# EAGLE board Z573 Holder Mark1 (EAGLE 9.6.2)
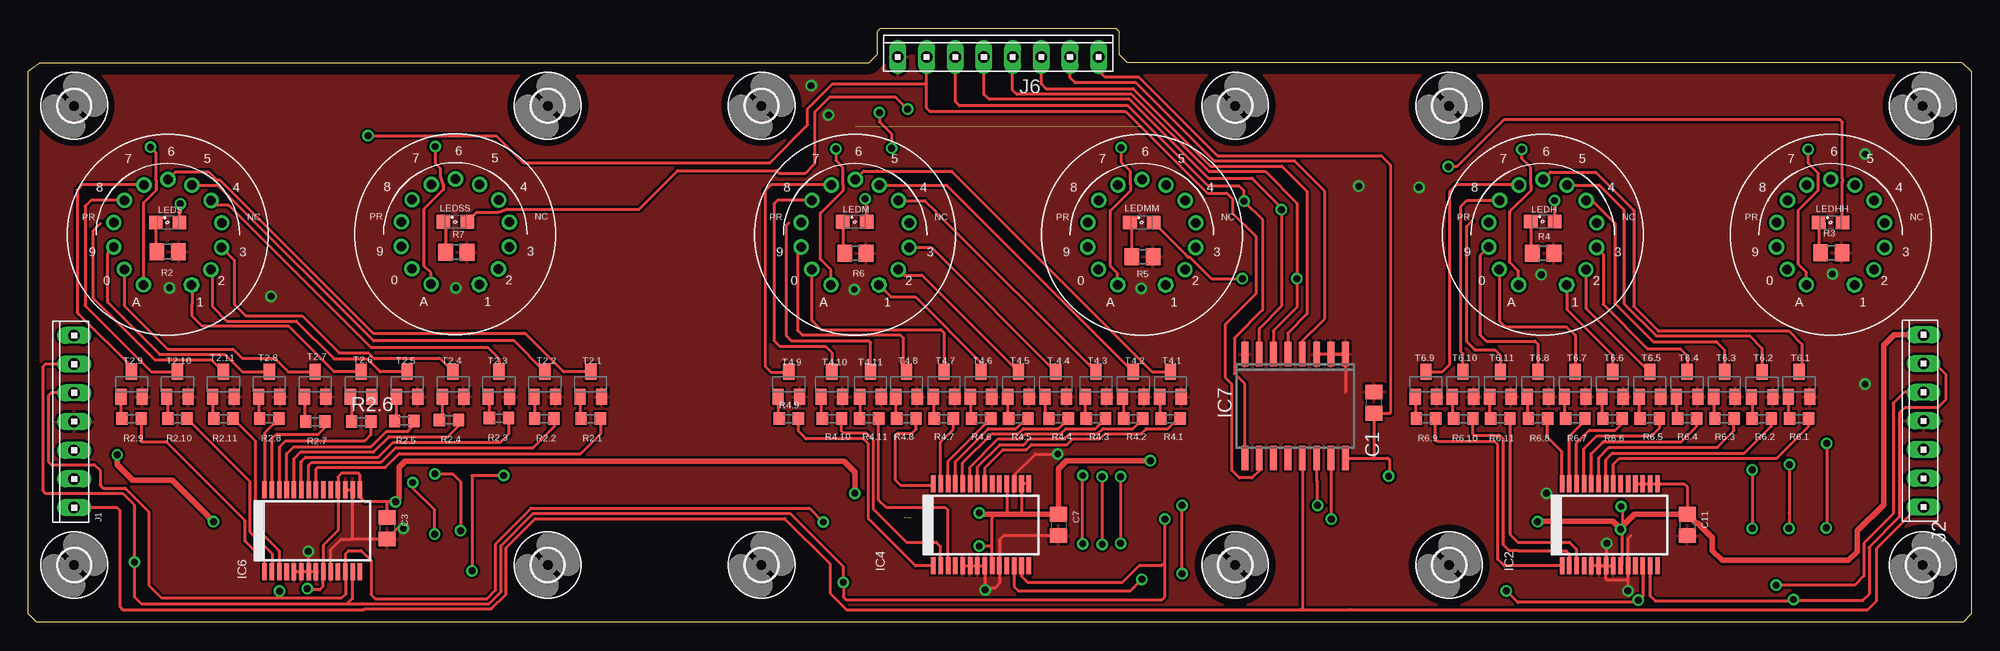
[diagram p3: board, top side]
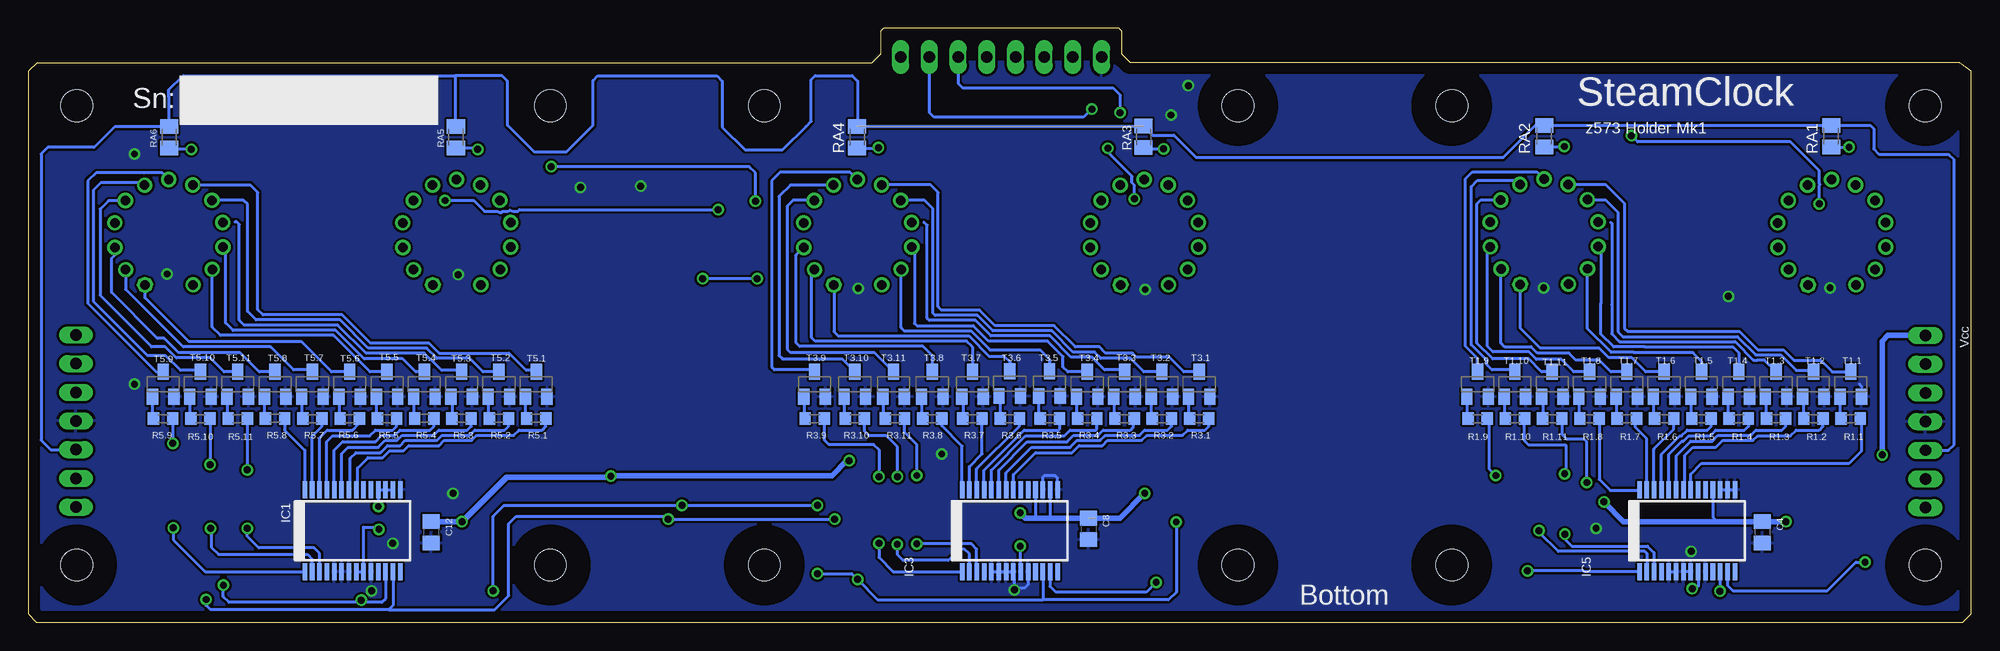
[diagram p4: board, bottom side, seen from below]

Size 171.96 x 52.58 mm. Coordinates in mm from the lower left corner, seen from the top.
Outline: 171.15,49.53 171.96,48.77 171.96,0.76 171.25,0 0.76,0 0,0.76 0,48.77 1.02,49.53 74.42,49.53 75.18,50.29 75.18,52.32 75.44,52.58 96.27,52.58 96.52,52.32 96.52,50.29 97.28,49.53 171.15,49.53
Copper layers (1*16): Top 0.035mm / dielectric 1.5mm / Bottom 0.035mm
Design rules "default": minimum track width 10mil, minimum drill 24mil, track to track 8mil, track to pad 8mil, pad to pad 8mil, via to via 8mil, smd to smd 8mil, copper to edge 40mil, drill to drill 8mil, minimum pad ring 10mil, minimum via ring 8mil, stop-mask expansion 4mil, vias tented up to drill 0mil, thermal gap 10mil

## Footprints (pad centres in the part's own frame; a part is rotated, then mirrored left to right if it is on the bottom)
C0805 = smd 1.3 x 1.5: 1 -0.95,0; 2 0.95,0
2,8 = hole 2.8: 0,0
SSOP28 = smd 0.4 x 1.5: 1 -4.225,-3.625; 2 -3.575,-3.625; 3 -2.925,-3.625; 4 -2.275,-3.625; 5 -1.625,-3.625; 6 -0.975,-3.625; 7 -0.325,-3.625; 8 0.325,-3.625; 9 0.975,-3.625; 10 1.625,-3.625; 11 2.275,-3.625; 12 2.925,-3.625; 13 3.575,-3.625; 14 4.225,-3.625; 15 4.225,3.625; 16 3.575,3.625; 17 2.925,3.625; 18 2.275,3.625; 19 1.625,3.625; 20 0.975,3.625; 21 0.325,3.625; 22 -0.325,3.625; 23 -0.975,3.625; 24 -1.625,3.625; 25 -2.275,3.625; 26 -2.925,3.625; 27 -3.575,3.625; 28 -4.225,3.625
SO16W = smd 0.6 x 2.2: 1 -4.445,-4.6; 2 -3.175,-4.6; 3 -1.905,-4.6; 4 -0.635,-4.6; 5 0.635,-4.6; 6 1.905,-4.6; 7 3.175,-4.6; 8 4.445,-4.6; 9 4.445,4.6; 10 3.175,4.6; 11 1.905,4.6; 12 0.635,4.6; 13 -0.635,4.6; 14 -1.905,4.6; 15 -3.175,4.6; 16 -4.445,4.6
10X07MTA = drill 1.016 long: 1 7.62,0; 2 5.08,0; 3 2.54,0; 4 0,0; 5 -2.54,0; 6 -5.08,0; 7 -7.62,0
10X08MTA = drill 1.016 long: 1 8.89,0; 2 6.35,0; 3 3.81,0; 4 1.27,0; 5 -1.27,0; 6 -3.81,0; 7 -6.35,0; 8 -8.89,0
SML0805 = smd 1.2 x 1.2: A 1.05,0; C -1.05,0
R0603 = smd 1 x 1.1: 1 -0.85,0; 2 0.85,0
R0805 = smd 1.3 x 1.5: 1 -0.95,0; 2 0.95,0
M0805 = smd 1.3 x 1.6: 1 -0.95,0; 2 0.95,0
SOT23 = smd 1 x 1.4: 1 -0.95,-1.1; 2 0.95,-1.1; 3 0,1.1
Z573M = drill 0.838 octagon: P$1 2.112,-4.422 | drill 0.838: P$2 3.821,-3.067; P$3 4.774,-1.106; P$4 4.781,1.075; P$5 3.841,3.043; P$6 2.14,4.408; P$7 0.016,4.9; P$8 -2.112,4.422; P$9 -3.821,3.067; P$10 -4.774,1.106; P$11 -4.781,-1.075; P$12 -3.841,-3.043; P$13 -2.14,-4.408

## Placement (x,y rotation side)
C1  0.1uF  [C0805]  119.08,19.46 90 top
C3  0.1uF  [C0805]  31.75,8.33 270 top
C4  0.1uF  [C0805]  18.49,7.98 270 bottom
C7  0.1uF  [C0805]  91.19,8.64 270 top
C8  0.1uF  [C0805]  78.13,8.28 270 bottom
C11  0.1uF  [C0805]  146.81,8.64 270 top
C12  0.1uF  [C0805]  136.3,7.98 270 bottom
H1  MOUNT-HOLE2.8  [2,8]  4.06,45.72 0 top
H6  MOUNT-HOLE2.8  [2,8]  45.97,45.72 0 top
H7  MOUNT-HOLE2.8  [2,8]  4.06,5.08 0 top
H8  MOUNT-HOLE2.8  [2,8]  45.97,5.08 0 top
H13  MOUNT-HOLE2.8  [2,8]  64.9,45.72 0 top
H14  MOUNT-HOLE2.8  [2,8]  106.81,45.72 0 top
H15  MOUNT-HOLE2.8  [2,8]  64.9,5.08 0 top
H16  MOUNT-HOLE2.8  [2,8]  106.81,5.08 0 top
H21  MOUNT-HOLE2.8  [2,8]  125.76,45.72 0 top
H22  MOUNT-HOLE2.8  [2,8]  167.67,45.72 0 top
H23  MOUNT-HOLE2.8  [2,8]  125.76,5.08 0 top
H24  MOUNT-HOLE2.8  [2,8]  167.67,5.08 0 top
IC1  MCP23017SS  [SSOP28]  143.26,8.13 0 bottom
IC2  MCP23017SS  [SSOP28]  139.95,8.64 0 top
IC3  MCP23017SS  [SSOP28]  85.09,8.13 0 bottom
IC4  MCP23017SS  [SSOP28]  84.33,8.64 0 top
IC5  MCP23017SS  [SSOP28]  25.15,8.13 0 bottom
IC6  MCP23017SS  [SSOP28]  25.15,8.13 0 top
IC7  PCF8574T  [SO16W]  112.12,19.15 180 top
J1  BUS  [10X07MTA]  4.06,17.78 90 top
J2  BUS  [10X07MTA]  167.74,17.83 90 top
J6  [10X08MTA]  85.85,50.04 0 top
LEDH  LS R976  [SML0805]  134.04,35.5 0 top
LEDHH  LS R976  [SML0805]  159.51,35.41 0.3 top
LEDM  LS R976  [SML0805]  73.15,35.46 0 top
LEDMM  LS R976  [SML0805]  98.55,35.41 0 top
LEDS  LS R976  [SML0805]  12.34,35.41 0 top
LEDSS  LS R976  [SML0805]  37.8,35.46 0 top
R1.1  10k  [R0603]  10.67,18.03 0 bottom
R1.2  10k  [R0603]  13.97,18.03 0 bottom
R1.3  10k  [R0603]  17.27,18.03 0 bottom
R1.4  10k  [R0603]  20.57,18.03 0 bottom
R1.5  10k  [R0603]  23.88,18.03 0 bottom
R1.6  10k  [R0603]  27.18,18.03 0 bottom
R1.7  10k  [R0603]  30.48,18.03 0 bottom
R1.8  10k  [R0603]  33.78,18.03 0 bottom
R1.9  10k  [R0603]  43.69,18.03 0 bottom
R1.10  10k  [R0603]  40.39,18.03 0 bottom
R1.11  10k  [R0603]  37.08,18.03 0 bottom
R2  1k  [R0805]  12.34,32.82 180 top
R2.1  10k  [R0603]  49.78,18.03 0 top
R2.2  10k  [R0603]  45.67,18.03 0 top
R2.3  10k  [R0603]  41.66,18.08 0 top
R2.4  10k  [R0603]  37.24,17.93 0 top
R2.5  10k  [R0603]  33.27,17.83 0 top
R2.6  10k  [R0603]  29.46,17.78 0 top
R2.7  10k  [R0603]  25.4,17.78 0 top
R2.8  10k  [R0603]  21.34,18.03 0 top
R2.9  10k  [R0603]  9.14,18.03 0 top
R2.10  10k  [R0603]  13.21,18.03 0 top
R2.11  10k  [R0603]  17.27,18.03 0 top
R3  1k  [R0805]  159.56,32.72 180 top
R3.1  10k  [R0603]  68.33,18.03 0 bottom
R3.2  10k  [R0603]  71.63,18.03 0 bottom
R3.3  10k  [R0603]  74.93,18.03 0 bottom
R3.4  10k  [R0603]  78.23,18.03 0 bottom
R3.5  10k  [R0603]  81.53,18.03 0 bottom
R3.6  10k  [R0603]  85.09,18.03 0 bottom
R3.7  10k  [R0603]  88.39,18.03 0 bottom
R3.8  10k  [R0603]  91.95,18.03 0 bottom
R3.9  10k  [R0603]  102.36,18.03 0 bottom
R3.10  10k  [R0603]  98.81,18.03 0 bottom
R3.11  10k  [R0603]  95.25,18.03 0 bottom
R4  1k  [R0805]  134.06,32.66 180 top
R4.1  10k  [R0603]  101.09,18.03 0 top
R4.2  10k  [R0603]  97.79,18.03 0 top
R4.3  10k  [R0603]  94.49,18.03 0 top
R4.4  10k  [R0603]  91.19,18.03 0 top
R4.5  10k  [R0603]  87.63,18.03 0 top
R4.6  10k  [R0603]  84.33,18.03 0 top
R4.7  10k  [R0603]  81.03,18.03 0 top
R4.8  10k  [R0603]  77.72,18.03 0 top
R4.9  10k  [R0603]  67.31,18.03 0 top
R4.10  10k  [R0603]  71.12,18.03 0 top
R4.11  10k  [R0603]  74.42,18.03 0 top
R5  1k  [R0805]  98.6,32.36 180 top
R5.1  10k  [R0603]  127,18.06 0 bottom
R5.2  10k  [R0603]  130.3,18.06 0 bottom
R5.3  10k  [R0603]  133.6,18.06 0 bottom
R5.4  10k  [R0603]  136.91,18.06 0 bottom
R5.5  10k  [R0603]  140.21,18.03 0 bottom
R5.6  10k  [R0603]  143.51,18.03 0 bottom
R5.7  10k  [R0603]  146.81,18.03 0 bottom
R5.8  10k  [R0603]  150.11,18.06 0 bottom
R5.9  10k  [R0603]  160.02,18.03 0 bottom
R5.10  10k  [R0603]  156.72,18.03 0 bottom
R5.11  10k  [R0603]  153.42,18.03 0 bottom
R6  1k  [R0805]  73.2,32.66 180 top
R6.1  10k  [R0603]  156.72,18.03 0 top
R6.2  10k  [R0603]  153.42,18.03 0 top
R6.3  10k  [R0603]  150.11,18.03 0 top
R6.4  10k  [R0603]  146.81,18.03 0 top
R6.5  10k  [R0603]  143.51,18.03 0 top
R6.6  10k  [R0603]  140.21,18.03 0 top
R6.7  10k  [R0603]  136.91,18.03 0 top
R6.8  10k  [R0603]  133.6,18.03 0 top
R6.9  10k  [R0603]  123.7,18.03 0 top
R6.10  10k  [R0603]  127,18.03 0 top
R6.11  10k  [R0603]  130.28,18.03 0 top
R7  1k  [R0805]  37.9,32.77 180 top
RA1  22k  [M0805]  12.4,43.03 270 bottom
RA2  22k  [M0805]  37.8,43.03 270 bottom
RA3  22k  [M0805]  73.25,42.98 270 bottom
RA4  22k  [M0805]  98.6,42.93 270 bottom
RA5  10k  [M0805]  134.11,42.93 270 bottom
RA6  10k  [M0805]  159.49,42.93 270 bottom
T1.1  MMBTA42  [SOT23]  10.67,21.08 0 bottom
T1.2  MMBTA42  [SOT23]  13.97,21.08 0 bottom
T1.3  MMBTA42  [SOT23]  17.27,21.08 0 bottom
T1.4  MMBTA42  [SOT23]  20.57,21.08 0 bottom
T1.5  MMBTA42  [SOT23]  23.88,21.08 0 bottom
T1.6  MMBTA42  [SOT23]  27.18,21.08 0 bottom
T1.7  MMBTA42  [SOT23]  30.48,21.08 0 bottom
T1.8  MMBTA42  [SOT23]  33.78,21.08 0 bottom
T1.9  MMBTA42  [SOT23]  43.69,21.08 0 bottom
T1.10  MMBTA42  [SOT23]  40.39,21.08 0 bottom
T1.11  MMBTA42  [SOT23]  37.08,21.08 0 bottom
T2.1  MMBTA42  [SOT23]  49.78,21.08 0 top
T2.2  MMBTA42  [SOT23]  45.72,21.08 0 top
T2.3  MMBTA42  [SOT23]  41.66,21.08 0 top
T2.4  MMBTA42  [SOT23]  37.59,21.08 0 top
T2.5  MMBTA42  [SOT23]  33.53,21.08 0 top
T2.6  MMBTA42  [SOT23]  29.46,21.08 0 top
T2.7  MMBTA42  [SOT23]  25.4,21.08 0 top
T2.8  MMBTA42  [SOT23]  21.34,21.08 0 top
T2.9  MMBTA42  [SOT23]  9.14,21.08 0 top
T2.10  MMBTA42  [SOT23]  13.21,21.08 0 top
T2.11  MMBTA42  [SOT23]  17.27,21.08 0 top
T3.1  MMBTA42  [SOT23]  68.33,21.08 0 bottom
T3.2  MMBTA42  [SOT23]  71.63,21.08 0 bottom
T3.3  MMBTA42  [SOT23]  74.93,21.08 0 bottom
T3.4  MMBTA42  [SOT23]  78.23,21.08 0 bottom
T3.5  MMBTA42  [SOT23]  81.58,21.13 0 bottom
T3.6  MMBTA42  [SOT23]  85.09,21.13 0 bottom
T3.7  MMBTA42  [SOT23]  88.39,21.08 0 bottom
T3.8  MMBTA42  [SOT23]  91.95,21.08 0 bottom
T3.9  MMBTA42  [SOT23]  102.36,21.08 0 bottom
T3.10  MMBTA42  [SOT23]  98.81,21.08 0 bottom
T3.11  MMBTA42  [SOT23]  95.38,21.08 0 bottom
T4.1  MMBTA42  [SOT23]  101.09,21.08 0 top
T4.2  MMBTA42  [SOT23]  97.79,21.08 0 top
T4.3  MMBTA42  [SOT23]  94.49,21.08 0 top
T4.5  MMBTA42  [SOT23]  87.63,21.08 0 top
T4.6  MMBTA42  [SOT23]  84.33,21.08 0 top
T4.7  MMBTA42  [SOT23]  81.05,21.08 0 top
T4.8  MMBTA42  [SOT23]  77.72,21.08 0 top
T4.9  MMBTA42  [SOT23]  67.31,21.08 0 top
T4.10  MMBTA42  [SOT23]  71.12,21.08 0 top
T4.11  MMBTA42  [SOT23]  74.55,21.08 0 top
T5.1  MMBTA42  [SOT23]  127,21.08 0 bottom
T5.2  MMBTA42  [SOT23]  130.3,21.08 0 bottom
T5.3  MMBTA42  [SOT23]  133.6,21.08 0 bottom
T5.4  MMBTA42  [SOT23]  136.91,21.08 0 bottom
T5.5  MMBTA42  [SOT23]  140.21,21.08 0 bottom
T5.6  MMBTA42  [SOT23]  143.51,21.08 0 bottom
T5.7  MMBTA42  [SOT23]  146.81,21.08 0 bottom
T5.8  MMBTA42  [SOT23]  150.11,21.08 0 bottom
T5.9  MMBTA42  [SOT23]  160.02,21.08 0 bottom
T5.10  MMBTA42  [SOT23]  156.72,21.08 0 bottom
T5.11  MMBTA42  [SOT23]  153.42,21.08 0 bottom
T6.1  MMBTA42  [SOT23]  156.72,21.08 0 top
T6.2  MMBTA42  [SOT23]  153.44,21.06 0 top
T6.3  MMBTA42  [SOT23]  150.11,21.08 0 top
T6.4  MMBTA42  [SOT23]  146.81,21.08 0 top
T6.5  MMBTA42  [SOT23]  143.51,21.08 0 top
T6.6  MMBTA42  [SOT23]  140.21,21.08 0 top
T6.7  MMBTA42  [SOT23]  136.91,21.08 0 top
T6.8  MMBTA42  [SOT23]  133.6,21.08 0 top
T6.9  MMBTA42  [SOT23]  123.7,21.08 0 top
T6.10  MMBTA42  [SOT23]  126.97,21.08 0 top
T6.11  MMBTA42  [SOT23]  130.28,21.08 0 top
T.4.4  MMBTA42  [SOT23]  90.93,21.08 0 top
U$1  Z573  [Z573M]  12.34,34.29 0 top
U$2  Z573  [Z573M]  37.8,34.34 0 top
U$3  Z573  [Z573M]  98.55,34.29 0 top
U$4  Z573  [Z573M]  73.18,34.29 0 top
U$5  Z573  [Z573M]  159.51,34.29 0 top
U$6  Z573  [Z573M]  134.04,34.29 0 top

## Tracks (layer width: path | path; a pad name or v marks a point on that pad's centre or on a via)
2-E10
  Top 0.254: T2.2.1 44.82,19.93 R2.2.1
2-E11
  Top 0.254: T2.3.1 40.81,19.88 R2.3.1
2-E12
  Top 0.254: T2.4.1 36.64,18.19 R2.4.1
2-E13
  Top 0.254: T2.5.1 32.58,17.98 R2.5.1
2-E15
  Top 0.254: R2.7.1 24.45,17.88 T2.7.1
2-E16
  Top 0.254: T2.8.1 20.39,18.13 R2.8.1
2-E17
  Top 0.254: T2.9.1 8.19,18.13 R2.9.1
2-E18
  Top 0.254: T2.10.1 12.36,19.88 R2.10.1
2-E19
  Top 0.254: R2.1.1 48.83,18.13 T2.1.1
2-E30
  Top 0.254: T4.2.1 96.94,19.88 R4.2.1
2-E31
  Top 0.254: T4.3.1 93.54,18.13 R4.3.1
2-E32
  Top 0.254: T.4.4.1 89.98,18.39 R4.4.1
2-E33
  Top 0.254: T4.5.1 86.68,18.13 R4.5.1
2-E34
  Top 0.254: R4.6.1 83.39,18.12 83.38,18.13 T4.6.1
2-E35
  Top 0.254: T4.7.1 80.1,18.11 R4.7.1
2-E36
  Top 0.254: T4.8.1 76.77,18.13 R4.8.1
2-E37
  Top 0.254: R4.9.1 66.36,18.13 T4.9.1
2-E38
  Top 0.254: T4.10.1 70.17,18.13 R4.10.1
2-E39
  Top 0.254: R4.1.1 100.14,18.13 T4.1.1
2-E50
  Top 0.254: T6.2.1 152.57,19.88 R6.2.1
2-E51
  Top 0.254: T6.3.1 149.16,18.13 R6.3.1
2-E52
  Top 0.254: T6.4.1 145.86,18.13 R6.4.1
2-E53
  Top 0.254: T6.5.1 142.56,18.13 R6.5.1
2-E54
  Top 0.254: T6.6.1 139.26,18.13 R6.6.1
2-E55
  Top 0.254: T6.7.1 135.96,18.13 R6.7.1
2-E56
  Top 0.254: T6.8.1 132.65,18.13 R6.8.1
2-E57
  Top 0.254: T6.9.1 122.75,18.13 R6.9.1
2-E58
  Top 0.254: T6.10.1 126.03,18.16 R6.10.1
2-E59
  Top 0.254: T6.1.1 155.77,18.13 R6.1.1
2-R12
  Top 0.254: IC6.23 24.17,14.2 24.16,14.26 24.54,14.63 30.97,14.63 32.28,15.94 41.79,15.94 42.51,16.65 R2.3.2
2-R16
  Top 0.254: R2.7.2 26.25,17.25 25.65,16.65 21.94,16.65 21.57,16.28 IC6.27
2-R17
  Top 0.254: R2.8.2 20.92,16.77 IC6.28
2-R18
  Top 0.254: R2.9.2 9.99,16 12.19,16 19.15,9.04 19.15,7.21 20.92,5.44 IC6.1
2-R19
  Top 0.254: IC6.2 21.57,6.08 19.61,8.04 19.61,12.48 R2.10.2
2-R30
  Top 0.254: R4.1.2 101.76,18.03 100.88,17.15 98.94,17.15 98.48,16.7 95.29,16.7 94.84,16.24 92.44,16.24 91.95,15.75 88.78,15.75 88.33,15.29 86.26,15.29 84.65,13.69 IC4.21
2-R31
  Top 0.254: R4.2.2 97.76,17.15 95.1,17.15 94.65,16.7 92.14,16.7 91.68,16.24 88.63,16.24 88.14,15.75 85.99,15.75 84,13.76 IC4.22
2-R32
  Top 0.254: R4.3.2 94.46,17.15 91.83,17.15 91.37,16.7 88.25,16.7 87.8,16.24 85.83,16.24 83.35,13.76 IC4.23
2-R33
  Top 0.254: R4.4.2 91.16,17.15 88.06,17.15 87.61,16.7 85.28,16.7 82.7,14.12 IC4.24
2-R34
  Top 0.254: R4.5.2 88.3,18.03 87.42,17.15 84.97,17.15 82.05,14.24 IC4.25
2-R35
  Top 0.254: IC4.26 81.4,14.26 R4.6.2
2-R36
  Top 0.254: R4.7.2 81.88,17.11 80.75,15.98 IC4.27
2-R37
  Top 0.254: R4.8.2 78.57,17.11 78.23,16.76 76.96,16.76 76.71,16.51 76.71,12.65 77.22,12.14 79.98,12.14 IC4.28
2-R38
  Top 0.254: R4.9.2 68.16,16.93 68.83,16.26 73.91,16.26 74.36,15.81 74.36,9.16 78.5,5.01 IC4.1
2-R39
  Top 0.254: R4.10.2 71.97,16.93 72.14,16.76 74.17,16.76 74.81,16.12 74.81,10.01 75.37,9.45 77.71,7.11 80.35,7.11 80.75,6.71 IC4.2
2-R50
  Top 0.254: R6.1.2 157.57,17.36 156.72,16.51 154.74,14.53 142.18,14.53 140.82,14.53 140.28,13.99 IC2.21
2-R51
  Top 0.254: R6.2.2 154.27,17.36 151.89,14.99 140.21,14.99 139.63,14.41 IC2.22
2-R52
  Top 0.254: R6.3.2 150.96,16.97 149.49,15.49 139.9,15.49 138.98,14.57 IC2.23
2-R53
  Top 0.254: R6.4.2 147.66,17.36 146.3,16 139.4,16 138.33,14.94 IC2.24
2-R54
  Top 0.254: R6.5.2 144.36,17.2 143.67,16.51 138.84,16.51 137.68,15.35 IC2.25
2-R55
  Top 0.254: R6.6.2 141.06,17.61 140.46,17.02 138.18,17.02 137.03,15.87 IC2.26
2-R56
  Top 0.254: R6.7.2 137.76,17.87 136.38,16.49 IC2.27
2-R57
  Top 0.254: IC2.28 135.73,15.1 134.45,16.37 R6.8.2
2-R58
  Top 0.254: R6.9.2 124.55,16.17 124.71,16 129.79,16 130.05,15.75 130.05,5.59 130.62,5.01 IC2.1
2-R59
  Top 0.254: R6.10.2 127.85,16.68 128.02,16.51 130.3,16.51 130.56,16.26 130.56,7.93 130.56,7.62 130.56,6.86 131.06,6.35 131.83,6.35 136.09,6.35 136.4,6.04 136.4,5.03 IC2.2
GND  (via drill 0.61)
  Top 0.254: T2.9.2 10.16,20.05 | T2.5.2 34.54,20.05 | 22.35,20.05 T2.8.2 22.1,20.17 | T6.8.2 134.62,20.05 | T6.7.2 137.92,20.05 | T6.6.2 141.22,20.05 | T6.5.2 144.53,20.05 | T6.1.2 157.73,20.05 | T6.2.2 154.43,20 | T6.3.2 151.13,20.05 | T6.4.2 147.83,20.05 | T4.1.2 102.11,20.05 | T4.11.2 75.69,20.18 | T4.8.2 78.74,20.05 | T4.7.2 82.3,20.28 | T4.6.2 85.6,20.3 | T4.5.2 88.65,20.05 | T.4.4.2 92.2,20.3 | T4.3.2 95.5,20.05 | T4.2.2 99.06,20.3 | IC7.1 IC7.3 | IC7.2 IC7.1 | IC6.17 IC6.16 28.72,7.38 | IC4.5 IC4.6 IC4.7 IC4.8 84.65,2.93 v84.68,2.9 84.84,3.05 85.55,3.05 85.95,3.45 IC4.10 85.95,7.31 86.32,7.69 C7.2 | IC2.7 IC2.5 | IC2.6 IC2.7 | IC7.1 116.56,20.41 | IC2.10 141.58,7.42 141.85,7.69 | IC6.7 24.82,6.27 v24.79,6.3 | IC2.7 139.7,5.08 v139.7,7.01 | IC2.10 141.58,3.86 141.48,3.76 139.75,3.76 139.63,3.88 IC2.7 | 28.72,7.38 C3.2 32.8,8.43 33.12,8.43 33.2,8.36 v33.2,8.32 | IC5.5 26.77,6.45 27.7,7.38 28.72,7.38 | IC2.10 v141.58,2.79 | IC6.8 IC6.7 | IC6.7 IC6.6 IC6.5 | IC4.17 87.37,12.38 87.37,13.15 89.13,14.91 v91.11,14.91 | IC2.7 IC2.8
  Bottom 0.254: 9.91,21.08 9.65,20.83 | 134.48,11.44 v134.37,11.43 | IC6.7 IC6.8 | IC3.17 82.16,12.88 82.04,13.01 81.08,13.01 80.86,12.79 IC3.15 | IC5.17 IC5.16 IC5.15 | IC5.5 IC5.6 | IC3.5 IC3.6 IC3.7 IC3.8 84.68,4.42 v84.68,2.9 84.53,3.05 83.77,3.05 83.47,3.35 IC3.10
  other vias: 162.56,21.08 21.49,28.85 70.82,44.91 69.29,47.5 159.66,30.84 133.91,30.78 98.5,29.57 73.1,29.46 37.85,29.62 12.5,29.62 123.09,38.51 117.75,38.61 162.56,41.45
  pour Bottom: -0.01,49.58 171.81,49.58 171.81,0 -0.01,0
  pour Top: -0.61,50.09 -0.61,-0.66 172.42,-0.66 172.42,50.09
H  (via drill 0.61)
  Top 0.254: J6.5 84.58,46.74 85.04,46.28 97.46,46.28 104.43,39.31 108.31,39.31 110.9,36.72 v110.9,36.52 110.9,27.96 108.94,26.01 IC7.7 | LEDH.A 135.09,37.33 v135.08,37.34
  Bottom 0.254: v135.08,37.34 132.54,37.34 131.57,36.37 130.44,36.37 130.15,36.27 129.95,36.37 129.55,36.37 129.33,36.48 129.02,36.37 128.63,36.37 128.47,36.52 v110.9,36.52
HH  (via drill 0.61)
  Top 0.254: IC7.9 107.67,21.11 106.73,22.05 106.73,25.15 109.25,27.66 109.25,32.89 109.22,32.92 109.22,35.66 v107.59,37.29 107.59,38.2 107.16,38.63 104.42,38.63 97.33,45.72 82.4,45.72 82.04,46.08 J6.6 | LEDHH.A 160.56,39.02 160.61,39.13 160.56,39.27 160.56,44.26 160.32,44.5 130.61,44.5 126.44,40.34 v125.68,40.34
  Bottom 0.254: v107.59,37.29 107.59,39.78 108.15,40.34 v125.68,40.34
HT  (1 unrouted)
  Bottom 0.254: J1.5 2.03,15.24 1.52,15.75 1.52,40.95 1.98,41.4 8.13,41.4 8.64,41.91 8.64,43.69 8.93,43.98 RA1.1 RA2.1 38.6,43.98 41.45,41.12 68.56,41.12 70.56,43.13 72.46,43.13 RA3.1 98.55,43.93 98.55,47.9 99.03,48.39 102.31,48.39 102.67,48.03 102.67,44.33 103.12,43.88 103.14,43.88 105.21,41.81 108.51,41.81 110.54,43.84 110.54,47.9 111,48.36 121.56,48.36 121.97,47.95 121.97,43.99 124.31,41.66 127.2,41.66 129.54,43.99 129.54,47.9 130.02,48.39 134.16,48.39 | J2.5 169.98,15.29 170.81,16.13 170.81,41.45 170.23,42.04 166.14,42.04 164.3,43.88 RA6.1 159.49,46.46 159.51,46.48 159.51,47.12 158.24,48.39 134.16,48.39 | RA5.1 134.11,48.34 134.16,48.39
INT
  Top 0.254: IC7.13 112.75,1.14 | J1.7 7.87,10.16 8.13,9.91 8.13,1.4 8.38,1.14 29.72,1.14 29.78,1.21 40.98,1.21 42.29,2.51 42.29,6.61 44.88,9.2 66.95,9.2 70.97,5.18 70.97,2.59 72.41,1.14 112.62,1.14 112.75,1.14 | J2.7 167.23,10.21 163.58,6.55 163.58,1.91 162.81,1.14 117.14,1.14 116.97,1.14 112.75,1.14
M  (via drill 0.61)
  Top 0.254: J6.3 89.66,47.65 90.07,47.24 97.79,47.24 104.65,40.39 110.95,40.39 113.18,38.15 113.18,27.3 111.48,25.6 IC7.5 | LEDM.A 74.2,37.36 v74.07,37.49 | v75.34,45.11 75.34,44.3 76.4,43.23 v76.4,41.96
  Bottom 0.254: v74.07,37.49 74.07,38.69 74.28,38.9 74.28,39.48 76.4,41.61 v76.4,41.96 | J6.3 89.66,47.7 89.26,47.3 75.95,47.3 75.34,46.69 v75.34,45.11
MM  (via drill 0.61)
  Top 0.254: J6.4 87.12,47.09 87.48,46.74 97.65,46.74 104.48,39.91 109.47,39.91 112.27,37.12 v112.27,30.43 112.27,27.89 110.19,25.81 110.19,23.78 IC7.6 | LEDMM.A 102.5,32.51 102.5,32.48 102.66,32.32 102.81,32.32 104.7,30.43 v107.44,30.43
  Bottom 0.254: v107.44,30.43 v112.27,30.43
N1-DOT  (via drill 0.61)
  Top 0.254: v35.97,7.82 35.97,9.96 34.04,11.89 v34.04,12.37 v34.02,12.38
  Bottom 0.254: R1.11.2 36.23,16.68 35.81,16.26 34.29,16.26 34.04,16 34.04,12.45 34.02,12.44 v34.02,12.38 | v35.97,7.82 35.97,7.37 35.36,6.76 28.65,6.76 28.07,6.18 IC5.3
N4-DOT
  Top 0.254: IC4.3 81.4,9.94 81.18,10.16 75.95,10.16 75.27,10.83 R4.11.2
N$2
  Top 0.254: R2.4.2 38.09,17.4 37.12,16.44 31.94,16.44 30.58,15.09 24.12,15.09 23.52,14.49 IC6.24
N$3
  Top 0.254: R2.1.2 50.63,16.69 48.88,14.94 32.83,14.94 31.61,13.72 25.6,13.72 25.47,13.58 IC6.21
N$4
  Bottom 0.254: R1.4.2 19.72,17.36 20.07,17.02 22.61,17.02 23.11,16.51 25.01,16.51 25.46,16.05 25.6,16.05 26.77,14.88 IC5.24
N$5
  Top 0.254: IC6.22 24.82,13.9 25.09,14.17 31.21,14.17 32.52,15.48 44.69,15.48 46.52,17.3 R2.2.2
N$6
  Bottom 0.254: R1.6.2 26.33,17.11 28.07,15.36 IC5.26
N$7
  Bottom 0.254: R1.7.2 29.72,18.03 29.72,17.27 28.72,16.27 IC5.27
N$8
  Bottom 0.254: R1.8.2 32.93,12.66 31.95,11.68 29.44,11.68 IC5.28
N$9  (via drill 0.61)
  Top 0.254: v42.09,13.01 39.27,13.01 v39.27,4.57
  Bottom 0.254: R1.9.2 42.67,17.87 42.67,13.59 v42.09,13.01 | IC5.1 34.22,4.5 34.29,4.57 v39.27,4.57
N$10  (via drill 0.61)
  Top 0.254: v35.99,13.16 37.57,13.16 38.25,12.47 v38.25,8.13
  Bottom 0.254: R1.10.2 39.54,16.09 39.55,16.08 39.17,15.7 35.89,15.7 35.89,13.26 v35.99,13.16 | v38.25,8.13 38.25,7.99 36.56,6.3 28.9,6.3 28.72,6.12 IC5.2
N$12
  Top 0.254: IC6.3 22.22,6.33 20.07,8.48 20.07,16.09 R2.11.2
N$13
  Top 0.254: T2.11.1 16.32,18.13 R2.11.1
N$14  (via drill 0.61)
  Top 0.254: U$2.P$13 35.66,30.94 35.05,31.54 35.05,36.6 36.77,38.31 36.77,38.7 36.5,39.48 36.5,40.15 36.02,40.63 v36.02,42.11
  Bottom 0.254: RA2.2 36.05,42.08 v36.02,42.11
N$15
  Bottom 0.254: R1.1.2 9.82,17.83 9.7,17.72 9.7,15.19 10.81,14.08 23.88,14.08 24.82,13.13 IC5.21
N$16
  Top 0.254: R2.5.2 34.12,17.46 33.58,16.92 31.7,16.92 30.33,15.54 23.47,15.54 22.87,14.95 IC6.25
N$17  (via drill 0.61)
  Top 0.254: U$3.P$13 96.41,30.89 95.76,31.54 95.76,36.45 97.58,38.26 97.58,38.72 97.53,38.76 97.53,39.93 96.72,40.74 v96.72,42.01
  Bottom 0.254: v96.72,42.01 96.76,41.98 RA4.2
N$18
  Top 0.254: R2.6.2 30.31,16.6 29.77,16.05 22.76,16.05 22.22,15.52 IC6.26
N$19
  Top 0.254: T2.6.1 28.61,19.88 R2.6.1
N$27
  Bottom 0.254: T1.2.1 14.82,19.88 R1.2.1
N$31
  Top 0.254: LEDS.C 11.29,32.92 R2.2
N$32
  Top 0.254: LEDHH.C 158.46,32.87 R3.2
N$33
  Top 0.254: LEDH.C 132.99,32.79 R4.2
N$34
  Top 0.254: LEDMM.C 97.65,35.26 R5.2
N$36
  Top 0.254: LEDM.C 72.1,32.81 R6.2
N$38
  Top 0.254: LEDSS.C 36.95,35.26 R7.2
N$51
  Bottom 0.254: T1.3.1 18.12,19.88 R1.3.1
N$52
  Bottom 0.254: T1.4.1 21.52,18.13 R1.4.1
N$53
  Bottom 0.254: T1.5.1 24.83,18.13 R1.5.1
N$54
  Bottom 0.254: T1.6.1 28.13,18.13 R1.6.1
N$55
  Bottom 0.254: R1.7.1 31.43,18.13 T1.7.1
N$56
  Bottom 0.254: T1.8.1 34.73,18.13 R1.8.1
N$57
  Bottom 0.254: T1.9.1 44.64,18.13 R1.9.1
N$58
  Bottom 0.254: T1.10.1 41.34,18.13 R1.10.1
N$59
  Bottom 0.254: T1.1.1 11.62,18.13 R1.1.1
N$61
  Bottom 0.254: R1.2.2 13.12,17.36 13.46,17.02 15.49,17.02 16,16.51 18.91,16.51 19.32,16.1 22,16.1 22.61,15.49 24.64,15.49 25.35,14.78 25.35,11.87 IC5.22
N$62
  Bottom 0.254: R1.3.2 16.42,17.36 16.76,17.02 19.05,17.02 19.51,16.56 22.42,16.56 22.93,16.05 24.82,16.05 26.12,14.75 IC5.23
N$64
  Bottom 0.254: R1.5.2 23.03,17.36 23.37,17.02 25.15,17.02 25.65,16.51 25.81,16.51 27.42,14.89 IC5.25
N$72  (via drill 0.61)
  Top 0.254: U$1.P$13 10.2,37.15 11.32,38.26 11.32,38.46 11.32,38.72 11.32,39.14 11.28,39.18 11.28,41.61 v10.82,42.06
  Bottom 0.254: RA1.2 12.38,42.06 v10.82,42.06
N$76
  Bottom 0.254: T1.11.1 37.93,19.88 R1.11.1
N$121
  Bottom 0.254: T3.2.1 72.58,18.13 R3.2.1
N$132
  Bottom 0.254: T3.3.1 75.88,18.13 R3.3.1
N$133
  Bottom 0.254: T3.4.1 79.18,18.13 R3.4.1
N$134
  Bottom 0.254: T3.5.1 82.53,18.18 R3.5.1
N$135
  Bottom 0.254: T3.6.1 85.94,19.93 R3.6.1
N$136
  Bottom 0.254: T3.7.1 89.24,19.88 R3.7.1
N$137
  Bottom 0.254: T3.8.1 92.9,18.13 R3.8.1
N$138
  Bottom 0.254: T3.9.1 103.31,18.13 R3.9.1
N$139
  Bottom 0.254: T3.10.1 99.76,18.13 R3.10.1
N$140
  Bottom 0.254: T3.1.1 69.28,18.13 R3.1.1
N$141
  Bottom 0.254: R3.1.2 67.48,17.36 67.82,17.02 69.34,17.02 69.8,16.56 72.96,16.56 73.42,16.1 76.44,16.1 76.9,15.65 78.96,15.65 79.57,15.04 82.8,15.04 84.77,13.08 IC3.21
N$142
  Bottom 0.254: R3.2.2 70.78,17.36 71.12,17.02 73.15,17.02 73.61,16.56 76.63,16.56 77.09,16.1 79.15,16.1 79.76,15.49 83.16,15.49 85.41,13.24 IC3.22
N$143
  Bottom 0.254: R3.3.2 74.17,17.95 74.17,17.27 74.42,17.02 76.82,17.02 77.28,16.56 79.45,16.56 80.02,15.99 83.55,15.99 86.06,13.48 IC3.23
N$144
  Bottom 0.254: R3.4.2 77.38,17.11 77.47,17.02 79.76,17.02 80.26,16.51 83.68,16.51 86.72,13.48 IC3.24
N$145
  Bottom 0.254: R3.5.2 80.68,17.11 80.77,17.02 83.82,17.02 87.36,13.47 IC3.25
N$146
  Bottom 0.254: R3.6.2 84.24,17.36 88.02,13.59 IC3.26
N$147
  Bottom 0.254: IC3.27 88.66,13.8 87.54,14.92 R3.7.2
N$148
  Bottom 0.254: IC3.28 89.31,15.6 91.1,17.39 R3.8.2
N$149  (via drill 0.61)
  Top 0.254: v96.67,12.9 v96.67,7.01
  Bottom 0.254: R3.9.2 101.51,16.17 101.09,15.75 97.13,15.75 96.67,15.29 v96.67,12.9 | IC3.1 95.4,4.5 96.67,5.77 v96.67,7.01
N$150  (via drill 0.61)
  Top 0.254: v95.03,12.9 95.05,12.89 v95.05,6.91
  Bottom 0.254: R3.10.2 97.96,16.93 97.54,16.51 96.01,16.51 95.03,15.53 v95.03,12.9 | IC3.2 88.66,6.06 89.1,6.5 89.51,6.5 90.53,5.49 94.54,5.49 95.05,5.99 v95.05,6.91
N$153  (via drill 0.61)
  Top 0.254: v71.48,41.91 71.48,40.89 72.11,40.26 72.11,38.76 72.15,38.72 72.15,38.26 70.1,36.22 70.1,32.12 71.04,31.19 U$4.P$13
  Bottom 0.254: v71.48,41.91 73.14,41.91 RA3.2
N$157
  Bottom 0.254: T3.11.1 96.33,18.26 R3.11.1
N$158
  Top 0.254: T4.11.1 73.6,18.06 R4.11.1
N$201
  Bottom 0.254: T5.2.1 131.25,18.16 R5.2.1
N$212
  Bottom 0.254: T5.3.1 134.45,19.88 R5.3.1
N$213
  Bottom 0.254: T5.4.1 137.86,18.16 R5.4.1
N$214
  Bottom 0.254: T5.5.1 141.16,18.13 R5.5.1
N$215
  Bottom 0.254: T5.6.1 144.46,18.13 R5.6.1
N$216
  Bottom 0.254: T5.7.1 147.76,18.13 R5.7.1
N$217
  Bottom 0.254: R5.8.1 151.06,18.16 T5.8.1
N$218
  Bottom 0.254: T5.9.1 160.97,18.13 R5.9.1
N$219
  Bottom 0.254: T5.10.1 157.67,18.13 R5.10.1
N$220
  Bottom 0.254: R5.1.1 127.95,18.16 T5.1.1
N$221
  Bottom 0.254: R5.1.2 126.15,17.36 126.49,17.02 128.52,17.02 128.98,16.56 132.26,16.56 132.72,16.1 135.14,16.1 135.6,15.65 138.28,15.65 138.73,15.19 139.98,15.19 140.59,14.58 141.88,14.58 142.81,13.65 142.81,11.87 IC1.21
N$222
  Bottom 0.254: R5.2.2 129.45,17.36 129.79,17.02 132.45,17.02 132.91,16.56 135.33,16.56 135.79,16.1 138.58,16.1 139.04,15.65 140.17,15.65 140.78,15.04 142.95,15.04 143.46,14.53 143.46,11.87 IC1.22
N$223
  Bottom 0.254: R5.3.2 132.75,17.36 133.1,17.02 135.64,17.02 136.09,16.56 138.86,16.56 139.32,16.1 140.36,16.1 140.97,15.49 143.66,15.49 144.23,14.93 IC1.23
N$224
  Bottom 0.254: R5.4.2 136.06,17.36 136.4,17.02 139.05,17.02 139.51,16.56 140.66,16.56 141.22,16 144.12,16 144.88,15.24 IC1.24
N$225
  Bottom 0.254: R5.5.2 139.36,17.36 139.7,17.02 141.22,17.02 141.73,16.51 145.03,16.51 145.53,16.01 IC1.25
N$226
  Bottom 0.254: R5.6.2 142.66,17.61 143.26,17.02 145.49,17.02 146.18,16.33 IC1.26
N$227
  Bottom 0.254: R5.7.2 145.96,17.36 146.83,16.49 IC1.27
N$228
  Bottom 0.254: IC1.28 147.48,15.25 149.26,17.03 R5.8.2
N$229  (via drill 0.61)
  Top 0.254: v159.17,15.85 159.17,8.38 v159.12,8.38
  Bottom 0.254: IC1.1 156.29,4.5 159.12,7.33 v159.12,8.38 | R5.9.2 v159.17,15.85
N$230  (via drill 0.61)
  Top 0.254: v155.87,13.97 155.87,9.69 155.85,9.7 155.85,8.37 v155.82,8.33
  Bottom 0.254: IC1.2 146.83,5.61 147.24,6.02 155.12,6.02 155.77,6.67 155.77,8.28 v155.82,8.33 | R5.10.2 v155.87,13.97
N$233  (via drill 0.61)
  Top 0.254: v132.18,41.86 132.18,41.05 132.97,40.26 132.97,38.76 133.01,38.72 133.01,38.26 131.12,36.37 131.12,31.87 131.9,31.09 U$6.P$13
  Bottom 0.254: v132.18,41.86 132.3,41.98 RA5.2
N$237
  Bottom 0.254: T5.11.1 154.37,18.13 R5.11.1
N$238
  Top 0.254: T6.11.1 129.33,18.13 R6.11.1
N$240  (via drill 0.61)
  Top 0.254: U$5.P$13 157.37,30.99 156.67,31.69 156.67,36.5 158.43,38.26 158.43,39.73 157.53,40.64 v157.53,41.86
  Bottom 0.254: v157.53,41.86 159.37,41.86 RA6.2
N$250  (via drill 0.61)
  Top 0.254: v152.57,13.51 v152.57,8.33
  Bottom 0.254: v152.57,8.33 152.57,7.62 151.55,6.6 146.66,6.6 146.18,6.12 IC1.3 | R5.11.2 v152.57,13.51
N$300
  Top 0.254: R6.11.2 131.13,7.81 131.83,7.11 136.4,7.11 137.03,6.48 IC2.3
N$345  (via drill 0.61)
  Top 0.254: v93.32,6.96 v93.32,13.01
  Bottom 0.254: R3.11.2 94.4,16.82 93.32,15.73 v93.32,13.01 | IC3.3 88.02,6.48 88.49,6.96 v93.32,6.96
S  (via drill 0.61)
  Top 0.254: 79.5,47.65 79.5,45.52 79.81,45.21 97.13,45.21 104.34,38 106.07,38 106.58,37.49 106.58,36.22 108.64,34.16 108.64,29.08 105.92,26.37 105.92,21.71 106.53,21.1 106.53,13.46 107.19,12.8 108.31,12.8 108.94,13.44 IC7.10 | 79.5,47.65 J6.7 | LEDS.A 13.39,36.97 v13.46,37.03 | v30.07,43.08 41.4,43.08 43.79,40.69 65.64,40.69 68.99,44.04 68.99,45.47 71.17,47.65 79.5,47.65
  Bottom 0.254: v13.46,37.03 13.46,38.59 13.4,38.76 13.46,38.89 13.46,39.98 16,42.52 29.52,42.52 v30.07,43.08
SCL  (via drill 0.61)
  Top 0.254: J1.3 2.03,20.32 1.78,20.07 1.78,14.22 2.03,13.97 5.84,13.97 6.35,13.46 6.35,12.19 6.66,11.89 8.57,11.89 10.67,9.79 10.67,3.3 11.81,2.16 22.25,2.16 | 142.49,1.88 142.88,2.26 IC2.12 | 142.49,1.88 142.39,1.78 131.83,1.78 v130.81,2.79 | v102.11,4.32 v102.11,10.36 | IC7.14 114.02,12.52 114.1,12.45 v114.1,10.36 | v98.55,3.81 97.54,2.79 87.63,2.79 87.25,3.17 IC4.12 | J2.3 166.01,20.37 165.05,19.41 165.05,9.6 162.46,7.01 162.46,4.12 161.65,3.3 v154.69,3.3 | v70.36,8.89 69.14,10.11 44.5,10.11 41.38,6.98 41.38,2.89 40.6,2.12 30.68,2.12 30.33,2.48 30.33,5.49 29.46,6.35 28.35,6.35 28.07,6.07 IC6.12 28.07,2.52 27.71,2.16 22.25,2.16 | v22.24,2.77 v22.25,2.77 22.25,2.16 | 142.49,1.88 v142.49,1.98
  Bottom 0.254: 142.29,1.78 140.66,1.78 140.33,2.11 IC1.12 | 142.29,1.78 154.18,1.78 154.69,2.29 v154.69,3.3 | v130.81,2.79 130.81,9.4 129.84,10.36 v114.1,10.36 v102.11,10.36 | v70.36,8.89 70.36,2.69 71.05,2 82.19,2 | 82.19,2 96.77,2 98.58,3.81 | v102.11,4.32 99.09,4.32 98.58,3.81 | 98.58,3.81 v98.55,3.81 | IC3.12 82.16,2.03 82.19,2 | IC5.12 22.24,4.48 v22.24,2.77 | v142.49,1.98 142.29,1.78
SDA  (via drill 0.61)
  Top 0.254: 28.24,1.65 10.01,1.65 9.4,2.26 v9.4,5.33 9.4,10.41 8.38,11.43 1.52,11.43 1.27,11.68 1.27,22.61 1.52,22.86 J1.2 | IC2.13 143.53,2.37 143.99,1.91 156.21,1.91 | 156.21,1.91 v156.21,2.03 | IC7.15 115.29,13.03 115.32,13.01 v115.32,9.14 | 100.58,5.33 100.33,5.08 98.35,5.08 96.83,3.56 88.44,3.56 87.9,4.1 IC4.13 | 100.58,5.33 v100.58,9.14 | 100.58,5.33 100.58,2.29 100.33,2.03 72.39,2.03 72.14,2.29 v72.14,3.56 72.14,4.93 67.41,9.65 44.69,9.65 41.83,6.79 41.83,2.7 40.79,1.66 29.59,1.66 29.58,1.65 28.24,1.65 | 156.21,1.91 162.33,1.91 162.92,2.49 162.92,6.65 165.61,9.35 165.61,18.54 166.06,19 169.01,19 169.72,19.71 169.72,21.95 168.76,22.91 J2.2 | 28.24,1.65 28.72,2.13 IC6.13
  Bottom 0.254: 140.06,1.14 155.83,1.14 156.21,1.52 v156.21,2.03 | 140.06,1.14 130.68,1.14 129.44,2.39 129.44,8.74 128.78,9.4 115.57,9.4 v115.32,9.14 v100.58,9.14 | v9.4,5.33 10.21,5.33 12.75,2.79 21.08,2.79 21.57,3.28 IC5.13 | IC1.13 139.68,1.52 140.06,1.14 | IC3.13 81.52,3.22 81.53,3.2 81.01,2.68 73.01,2.68 v72.14,3.56
SS  (via drill 0.61)
  Top 0.254: J6.2 92.2,48.21 92.66,47.75 98.04,47.75 104.95,40.84 112.06,40.84 114.71,38.2 114.71,26.82 113.64,25.76 113.59,25.76 112.75,24.92 IC7.4 | LEDSS.A 39.69,36.3 41.57,36.3 42.36,36.57 42.36,36.58 54.05,36.58 57.45,39.98 66.19,39.98 66.45,39.73 68.73,39.73 69.6,40.59 69.6,45.16 70.92,46.48 76.76,46.48 v77.83,45.41
  Bottom 0.254: J6.2 92.2,45.11 91.8,44.7 78.59,44.7 78.13,45.16 78.13,45.41 v77.83,45.41
T1.1
  Bottom 0.254: U$2.P$8 32.36,38.76 30.68,37.08 30.68,26.01 30.43,25.76 20.51,25.76 18.89,24.13 16.61,24.13 15.69,23.21 13.33,23.21 12.3,22.18 T1.1.3
T1.2
  Bottom 0.254: T1.2.3 13.97,22.3 15.49,22.3 16.87,23.67 19.08,23.67 20.7,25.3 30.84,25.3 31.27,25.73 31.27,36.29 32.37,37.39 33.96,37.39 U$2.P$9
T1.3
  Bottom 0.254: 31.9,35.41 31.83,35.33 31.83,28.12 31.83,25.53 31.14,24.84 20.89,24.84 19.27,23.22 18.95,23.22 18.31,23.22 T1.3.3
T1.4
  Bottom 0.254: T1.4.3 20.57,23.88 21.08,24.38 28.91,24.38 31.65,24.38 32.76,25.5 32.76,28.24 32.76,28.45 32.76,33.01 U$2.P$11
T1.5
  Bottom 0.254: T1.5.3 23.88,23.11 24.64,23.88 29.85,23.88 29.87,23.89 31.87,23.89 33.95,25.98 U$2.P$12
T1.6
  Bottom 0.254: T1.6.3 28.8,22.18 30.05,23.44 32.09,23.44 32.93,24.28 38.15,24.28 39.91,26.04 U$2.P$1
T1.7
  Bottom 0.254: T1.7.3 31.88,22.18 32.89,23.19 33.12,23.19 33.14,23.21 35,23.21 35.61,23.82 38.38,23.82 38.96,24.4 41.3,24.4 41.64,24.75 41.64,31.25 U$2.P$2
T1.8
  Bottom 0.254: T1.8.3 35.19,22.18 36.3,23.29 38.49,23.29 39.15,23.95 42.33,23.95 42.82,24.44 42.82,32.98 U$2.P$3
T1.9
  Bottom 0.254: T1.9.3 43.69,23.37 44.76,24.43 44.76,39.27 44.14,39.88 38.45,39.88 U$2.P$7
T1.10
  Bottom 0.254: U$2.P$6 40.3,39.12 43.69,39.12 44.25,38.56 44.25,24.57 42.86,23.18 42.86,22.79 42.42,22.35 40.56,22.35 T1.10.3
T1.11
  Bottom 0.254: T1.11.3 38.03,22.18 39.17,23.32 42.34,23.32 43.74,24.71 43.74,37.03 43.39,37.38 U$2.P$5
T2.1
  Top 0.254: T2.1.3 47.39,22.18 43.97,25.6 30.52,25.6 16.96,39.16 16.67,39.16 15.95,39.88 13.05,39.88 U$1.P$7
T2.2
  Top 0.254: T2.2.3 42.99,24.91 30.56,24.91 17.75,37.72 16.78,38.7 U$1.P$6
T2.3
  Top 0.254: U$1.P$5 16.56,36.95 17.7,36.95 30.32,24.33 40.64,24.33 41.66,23.32 T2.3.3
T2.4
  Top 0.254: T2.4.3 36.39,23.39 32.11,23.39 30.57,23.39 30.1,23.86 27.5,23.86 24.23,27.13 19.25,27.13 18.24,28.14 18.24,32.06 U$1.P$3
T2.5
  Top 0.254: T2.5.3 31.13,22.18 29.98,23.33 27.06,23.33 23.72,26.67 17.58,26.67 16.31,27.94 16.31,31.08 U$1.P$2
T2.6
  Top 0.254: T2.6.3 27.07,22.18 23.04,26.21 15.39,26.21 14.53,27.08 14.53,28.25 14.53,29.8 U$1.P$1
T2.7
  Top 0.254: T2.7.3 23,22.18 21.8,23.38 18.94,23.38 18.14,24.18 12.34,24.18 8.5,28.02 U$1.P$12
T2.8
  Top 0.254: T2.8.3 18.94,22.18 17.4,23.72 11.63,23.72 7.21,28.14 7.01,28.35 7.01,32.66 U$1.P$11
T2.9
  Top 0.254: T2.9.3 9.14,22.63 4.48,27.29 4.32,27.45 4.32,38.25 4.78,38.71 U$1.P$8
T2.10
  Top 0.254: T2.10.3 10.89,22.18 5.56,27.51 5.03,28.04 5.03,36.83 5.56,37.36 U$1.P$9
T2.11
  Top 0.254: T2.11.3 16.19,23.27 11.18,23.27 5.74,28.7 5.74,34.65 6.4,35.31
T3.1
  Bottom 0.254: T3.1.3 69.68,22.18 70.97,23.47 73.88,23.47 74.23,23.82 76.61,23.82 77.16,24.38 79.29,24.38 81.17,26.26 86.39,26.26 87.76,27.64 91.14,27.64 91.44,27.94 91.44,38.05 92.1,38.71 U$3.P$8
T3.2
  Bottom 0.254: T3.2.3 73.24,22.18 74.42,23.37 77.03,23.37 77.58,23.93 79.48,23.93 81.36,25.81 86.58,25.81 87.95,27.18 91.69,27.18 91.9,27.38 91.9,36.63 92.63,37.36 U$3.P$9
T3.3
  Bottom 0.254: T3.3.3 75.1,22.35 76.71,22.35 77.72,23.37 77.72,23.42 77.78,23.47 79.67,23.47 81.55,25.35 86.77,25.35 88.14,26.72 92.2,26.72 92.41,26.92 92.41,35.15 92.66,35.41 92.71,35.41
T3.4
  Bottom 0.254: U$3.P$11 93.52,32.97 93.52,26.47 93.32,26.26 88.33,26.26 86.96,24.89 81.74,24.89 80.37,23.52 80.37,22.61 79.94,22.18 T3.4.3
T3.5
  Bottom 0.254: T3.5.3 81.58,23.3 82.41,24.13 86.84,24.13 88.52,25.81 94.44,25.81 94.71,26.08 U$3.P$12
T3.6
  Bottom 0.254: U$3.P$1 100.66,25.73 100.28,25.35 88.71,25.35 86.93,23.57 85.6,23.57 85.09,23.06 T3.6.3
T3.7
  Bottom 0.254: T3.7.3 88.39,24.38 88.9,24.89 102.31,24.89 102.62,25.2 102.62,30.98 U$3.P$2
T3.8
  Bottom 0.254: T3.8.3 91.95,23.62 92.76,24.43 103.68,24.43 103.99,24.74 103.99,32.52 U$3.P$3
T3.9
  Bottom 0.254: T3.9.3 102.53,22.35 105.92,22.35 106.17,22.61 106.17,39.06 105.36,39.88 99.26,39.88 U$3.P$7
T3.10
  Bottom 0.254: T3.10.3 99.94,23.32 105.21,23.32 105.51,23.62 105.51,37.69 104.51,38.7 U$3.P$6
T3.11
  Bottom 0.254: U$3.P$5 104.29,37.34 104.8,36.83 104.8,24.18 104.5,23.88 97.07,23.88 T3.11.3
T4.1
  Top 0.254: T4.1.3 99.46,22.18 81.71,39.93 75.18,39.93 75.03,39.93 73.93,39.93 U$4.P$7
T4.2
  Top 0.254: T4.2.3 82.69,37.28 81.27,38.7 U$4.P$6
T4.3
  Top 0.254: T4.3.3 80.36,36.31 80.19,36.48 79.34,37.33 U$4.P$5
T4.4
  Top 0.254: T.4.4.3 80.28,32.83 79.93,33.18 U$4.P$3
T4.5
  Top 0.254: T4.5.3 79.09,30.73 77.5,30.73 U$4.P$2
T4.6
  Top 0.254: T4.6.3 84.33,23 78.52,28.81 76.35,28.81 U$4.P$1
T4.7
  Top 0.254: T4.7.3 81.05,25.63 80.77,25.91 70.16,25.91 69.34,26.73 U$4.P$12
T4.8
  Top 0.254: T4.8.3 77.47,22.44 77.47,25.15 77.22,25.4 68.53,25.4 68.07,25.86 68.07,32.89 U$4.P$11
T4.9
  Top 0.254: T4.9.3 67.31,22.2 67.26,22.15 65.73,22.15 65.23,22.66 65.23,38.2 65.74,38.71 U$4.P$8
T4.10
  Top 0.254: T4.10.3 71.12,23.88 70.56,24.43 66.5,24.43 65.99,24.94 65.99,37.03 66.29,37.34 68.83,37.34 68.85,37.36 U$4.P$9
T4.11
  Top 0.254: T4.11.3 74.55,24.77 74.42,24.89 67.56,24.89 67.11,25.35 67.11,35.15 67.31,35.36
T5.1
  Bottom 0.254: U$5.P$8 152.3,38.71 151.64,38.05 151.64,27.69 151.18,27.23 144.18,27.23 141.69,24.74 136.5,24.74 135.59,23.82 129.41,23.82 127.89,22.3 127.12,22.3 T5.1.3
T5.2
  Bottom 0.254: U$5.P$9 152.88,37.36 152.55,37.03 152.55,27.53 151.79,26.77 144.36,26.77 141.88,24.28 136.69,24.28 135.78,23.37 132.89,23.37 131.71,22.18 T5.2.3
T5.3
  Bottom 0.254: 153.66,35.45 153.51,35.45 153.29,35.23 153.29,26.75 152.86,26.31 144.55,26.31 142.06,23.82 136.91,23.82 136.29,23.21 136.27,23.21 135.36,22.3 133.72,22.3 T5.3.3
T5.4
  Bottom 0.254: T5.4.3 137.67,22.18 138.82,23.33 142.22,23.33 144.74,25.86 153.82,25.86 154.48,26.52 154.48,32.97 U$5.P$11
T5.5
  Bottom 0.254: T5.5.3 141.71,22.18 144.93,25.4 154.94,25.4 155.67,26.13 U$5.P$12
T5.6
  Bottom 0.254: T5.6.3 145.12,22.18 147.78,24.84 157.73,24.84 161.62,28.73 U$5.P$1
T5.7
  Bottom 0.254: U$5.P$2 163.33,29.48 159.56,25.71 158.24,24.38 150.52,24.38 148.49,22.35 146.98,22.35 T5.7.3
T5.8
  Bottom 0.254: U$5.P$3 164.29,32.51 164.59,32.21 164.59,29.21 160.53,25.15 159.93,25.15 158.66,23.88 153.21,23.88 151.52,22.18 T5.8.3
T5.9
  Bottom 0.254: T5.9.3 160.61,22.18 166.68,28.25 166.68,39.06 165.96,39.78 161.73,39.78 161.72,39.78 161.7,39.78 160.11,39.78 U$5.P$7
T5.10
  Bottom 0.254: U$5.P$6 161.9,38.95 165.51,38.95 166.17,38.29 166.17,28.38 161.41,23.62 159.79,23.62 158.47,22.3 156.84,22.3 T5.10.3
T5.11
  Bottom 0.254: U$5.P$5 164.85,37.33 165.61,36.58 165.61,28.96 161.04,24.38 159.82,24.38 158.85,23.42 155.85,23.42 154.62,22.18 T5.11.3
T6.1
  Top 0.254: T6.1.3 156.97,22.44 156.97,24.64 155.8,25.81 144.26,25.81 142.09,27.98 142.09,36.47 138.72,39.84 134.71,39.84 U$6.P$7
T6.2
  Top 0.254: T6.2.3 153.44,24.29 152.38,25.35 144.07,25.35 141.21,28.2 141.21,36.52 139.03,38.7 U$6.P$6
T6.3
  Top 0.254: T6.3.3 150.11,24.13 149.4,24.84 143.81,24.84 140.41,28.25 140.41,35.3 138.45,37.26 137.95,37.26 U$6.P$5
T6.4
  Top 0.254: U$6.P$3 139.4,32.6 139.4,28.14 143.31,24.23 146.2,24.23 146.81,23.62 T6.4.3
T6.5
  Top 0.254: T6.5.3 143.51,22.25 143.41,22.25 137.86,27.8 U$6.P$2
T6.6
  Top 0.254: T6.6.3 140.21,23.67 136.15,27.73 U$6.P$1
T6.7
  Top 0.254: T6.7.3 136.91,25.4 136.14,26.16 130.71,26.16 130.19,26.68 U$6.P$12
T6.8
  Top 0.254: T6.8.3 133.6,24.64 133.35,24.89 129.03,24.89 128.47,25.45 128.47,32.43 U$6.P$11
T6.9
  Top 0.254: U$6.P$8 126.39,38.71 125.78,38.1 125.78,22.81 125.12,22.15 123.73,22.15 T6.9.3
T6.10
  Top 0.254: U$6.P$9 127.32,37.36 126.8,36.83 126.8,23.94 126.97,23.76 T6.10.3
T6.11
  Top 0.254: T6.11.3 130.28,23.65 129.79,24.13 128.02,24.13 127.31,24.84 127.31,35.05 127.76,35.51
VCC  (via drill 0.61)  (1 unrouted)
  Top 0.254: 166.17,25.45 J2.1 | 116.51,14.6 IC7.16 119,14.55 | 31.71,9.25 C3.1 31.75,10.62 31.8,10.67 | C11.1 146.81,11.99 146.54,12.26 IC2.15 IC2.16 IC2.17 IC2.18 | IC2.9 141.03,5.11 141.03,8.24 v140.93,8.24 141.07,8.38 141.07,10.16 v140.97,10.26 | C7.1 88.59,9.59 | 88.59,9.59 88.04,9.59 | 88.04,9.59 87.88,9.59 | 87.88,9.59 86.56,9.59 | 86.56,9.59 85.63,9.59 85.3,9.26 85.3,6.65 | IC4.16 87.95,12.21 | 87.95,9.66 87.88,9.59 | 88.55,9.63 88.59,9.59 | IC4.9 85.3,6.65 | v32.51,10.67 31.8,10.67 | 31.8,10.67 29.78,10.67 29.37,11.07 IC6.15 29.37,13.05 29.21,13.21 27.74,13.21 27.42,12.89 IC6.18 27.42,8.15 26.11,6.84 26.11,4.51 IC6.9 26.12,3.21 25.81,2.9 24.79,2.9 v24.69,3 | IC4.15 IC4.16 | IC4.16 87.9,9.72 88.04,9.59 | IC4.18 86.6,9.63 86.56,9.59 | 85.3,6.65 85.2,6.76 v84.17,6.76 | J6.1 95.15,49.63 95.15,48.72 94.74,49.12 94.64,49.12 94.64,48.92 95.3,48.26 98.3,48.26 105.26,41.3 119.74,41.3 120.55,40.49 120.55,18.51 C1.1 119.08,14.48 119,14.55 | 119,14.55 120.32,14.55 120.45,14.43 120.45,13.01 v120.4,12.95
  Top 0.508: v84.17,9.7 84.28,9.59 86.56,9.59 88.04,9.59 C7.1 91.19,13.61 91.9,14.33 v99.31,14.33 | J2.1 165.15,25.45 164.21,24.51 164.21,10.44 161.87,8.1 161.87,6.27 161.09,5.49 149.91,5.49 149.05,6.35 149.05,7.5 147.75,8.79 147.6,8.79 C11.1 142.12,9.59 140.93,8.39 v140.93,8.24 140.23,8.94 133.58,8.94 v133.57,8.93 | v32.51,10.67 32.82,10.97 32.82,13.72 33.38,14.28 72.19,14.28 73.15,13.31 v73.15,11.43 | v16.41,8.93 12.74,12.6 9.25,12.6 7.87,13.97 v7.87,14.83
  Bottom 0.254: 120.4,12.85 v120.4,12.95 | IC1.16 IC1.17 IC1.18 140.98,10.27 v140.97,10.26 | 77.47,9.33 77.52,9.27 | 82.8,11.74 IC3.18 82.81,9.24 82.8,9.23 | 81.53,11.73 IC3.16 81.52,9.26 81.48,9.23 | IC5.18 22.87,9.31 22.49,8.93 C4.1 | v84.17,6.76 84.17,4.55 IC3.9 | v84.17,9.7 83.73,9.27 83.73,9.23 | v140.93,8.24 141.13,8.44 142.28,8.44 IC1.9 IC1.8 | IC5.9 24.17,3.21 24.69,2.69 v24.69,3
  Bottom 0.508: C12.1 v133.57,8.93 129.64,12.85 120.4,12.85 | v120.4,12.95 120.34,13.01 100.84,13.01 99.52,14.33 v99.31,14.33 | v73.15,11.43 75.35,9.23 C8.1 | v7.87,14.83 7.87,24.89 7.37,25.4 J1.1 | 78.17,9.27 C8.1 | v32.51,10.67 30.77,8.93 C4.1 v16.41,8.93 | v84.17,9.7 83.69,9.23 82.8,9.23 81.48,9.23 C8.1 | v140.93,8.24 140.85,8.32

## Text on the board
bNames: SteamClock | Sn: | z573 Holder Mk1 | Vcc | Bottom
bValues: SDA | SCL | GND | HT | IRQ